# EAGLE schematic oneAxisServoController (EAGLE 7.3.0)
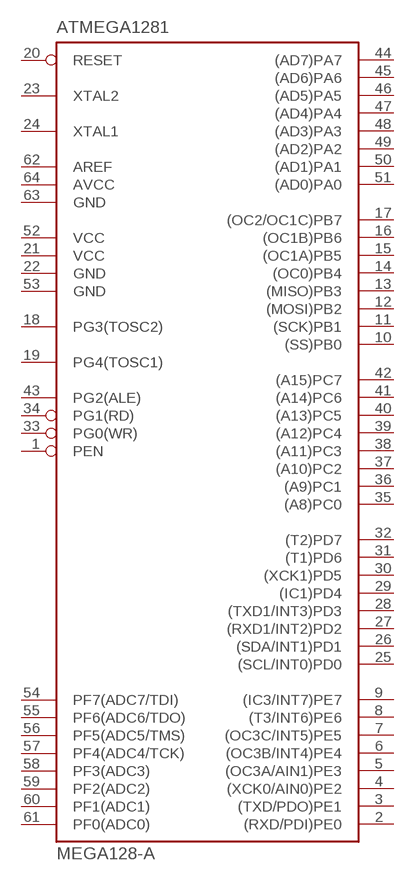
[diagram p0: schematic, sheet 1]

## Parts
ATMEGA1281  MEGA128-A  [TQFP64]
Unconnected: ATMEGA1281.1(PEN) ATMEGA1281.2((RXD/PDI)PE0) ATMEGA1281.3((TXD/PDO)PE1) ATMEGA1281.4((XCK0/AIN0)PE2) ATMEGA1281.5((OC3A/AIN1)PE3) ATMEGA1281.6((OC3B/INT4)PE4) ATMEGA1281.7((OC3C/INT5)PE5) ATMEGA1281.8((T3/INT6)PE6) ATMEGA1281.9((IC3/INT7)PE7) ATMEGA1281.10((SS)PB0) ATMEGA1281.11((SCK)PB1) ATMEGA1281.12((MOSI)PB2) ATMEGA1281.13((MISO)PB3) ATMEGA1281.14((OC0)PB4) ATMEGA1281.15((OC1A)PB5) ATMEGA1281.16((OC1B)PB6) ATMEGA1281.17((OC2/OC1C)PB7) ATMEGA1281.18(PG3(TOSC2)) ATMEGA1281.19(PG4(TOSC1)) ATMEGA1281.20(RESET) ATMEGA1281.23(XTAL2) ATMEGA1281.24(XTAL1) ATMEGA1281.25((SCL/INT0)PD0) ATMEGA1281.26((SDA/INT1)PD1) ATMEGA1281.27((RXD1/INT2)PD2) ATMEGA1281.28((TXD1/INT3)PD3) ATMEGA1281.29((IC1)PD4) ATMEGA1281.30((XCK1)PD5) ATMEGA1281.31((T1)PD6) ATMEGA1281.32((T2)PD7) ATMEGA1281.33(PG0(WR)) ATMEGA1281.34(PG1(RD)) ATMEGA1281.35((A8)PC0) ATMEGA1281.36((A9)PC1) ATMEGA1281.37((A10)PC2) ATMEGA1281.38((A11)PC3) ATMEGA1281.39((A12)PC4) ATMEGA1281.40((A13)PC5) ATMEGA1281.41((A14)PC6) ATMEGA1281.42((A15)PC7) ATMEGA1281.43(PG2(ALE)) ATMEGA1281.44((AD7)PA7) ATMEGA1281.45((AD6)PA6) ATMEGA1281.46((AD5)PA5) ATMEGA1281.47((AD4)PA4) ATMEGA1281.48((AD3)PA3) ATMEGA1281.49((AD2)PA2) ATMEGA1281.50((AD1)PA1) ATMEGA1281.51((AD0)PA0) ATMEGA1281.54(PF7(ADC7/TDI)) ATMEGA1281.55(PF6(ADC6/TDO)) ATMEGA1281.56(PF5(ADC5/TMS)) ATMEGA1281.57(PF4(ADC4/TCK)) ATMEGA1281.58(PF3(ADC3)) ATMEGA1281.59(PF2(ADC2)) ATMEGA1281.60(PF1(ADC1)) ATMEGA1281.61(PF0(ADC0)) ATMEGA1281.62(AREF)

## Power pins joined to a net without a drawn wire
AVCC: ATMEGA1281.64(AVCC)
GND: ATMEGA1281.22(GND) ATMEGA1281.53(GND) ATMEGA1281.63(GND)
VCC: ATMEGA1281.21(VCC) ATMEGA1281.52(VCC)

## Library data of the parts
ATMEGA1281 = atmel:MEGA128: MICROCONTROLLER 128 Kbytes FLASH 4 Kbytes SRAM 4 Kbytes EEPROM DUAL USART 8-channel 10 bit ADC Source: avr.lbr; MPN: ATMEGA128-16AU; OC_FARNELL: 9171118; OC_NEWARK: 95K7364